# Altium project fitness_rubber_band_monitor_pcb.PrjPcb
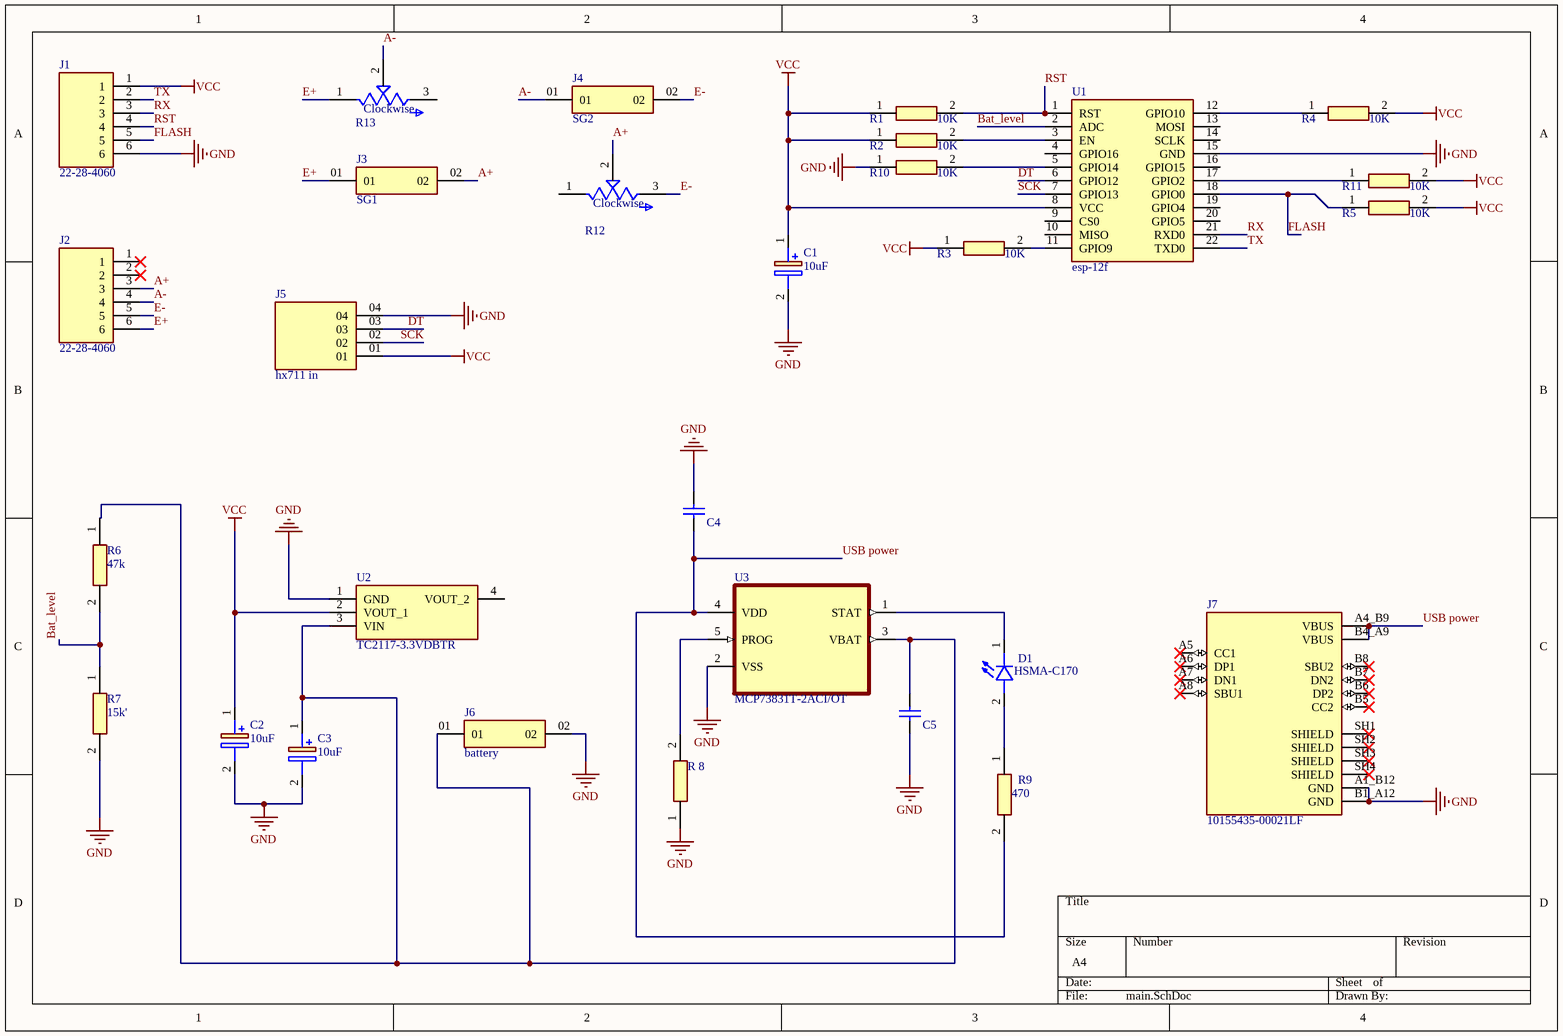
[diagram p0: main.SchDoc]
1 sheet, 29 parts. Net scope: global (net labels, ports and power ports of the same name join across sheets).
Board file: main.PcbDoc

## Sheet main.SchDoc
size A4; SheetNumber: 1; SheetTotal: 1

### Parts
C1  10uF  [EEE1AA220WR]
C2  10uF  [EEE1AA220WR]
C3  10uF  [EEE1AA220WR]
C4  4.7uF  [WCAP-CSGP_0805_L2W1.25H0.6_Reflow]  (value not drawn)
C5  4.7uF  [WCAP-CSGP_0805_L2W1.25H0.6_Reflow]  (value not drawn)
D1  HSMA-C170  [LED_HSMA-C170]
J1  22-28-4060  [HDRV6W66P0X254_1X6_1524X249X838P]
J2  22-28-4060  [HDRV6W66P0X254_1X6_1524X249X838P]
J3  SG1  [SAMTEC_MTSW-101-08-G-D-250]
J4  SG2  [SAMTEC_MTSW-101-08-G-D-250]
J5  hx711 in  [SAMTEC_TSW-104-16-G-S]
J6  battery  [SAMTEC_MTSW-101-08-G-D-250]
J7  10155435-00021LF  [AMPHENOL_10155435-00021LF]
R1  10K  [RESC2012X60N]
R2  10K  [RESC2012X60N]
R3  10K  [RESC2012X60N]
R4  10K  [RESC2012X60N]
R5  10K  [RESC2012X60N]
R6  47k  [RESC2012X60N]
R7  15k'  [RESC2012X60N]
R9  470  [RESC2012X60N]
R10  10K  [RESC2012X60N]
R11  10K  [RESC2012X60N]
R12  PV37W501C01B00  [TRIM_PV37W501C01B00]  (value not drawn)
R13  PV37W501C01B00  [TRIM_PV37W501C01B00]  (value not drawn)
R_8  CR0805-JW-202ELF  [RESC2012X60N]  (value not drawn)
U1  esp-12f  [esp12f]
U2  TC2117-3.3VDBTR  [SOT230P700X180-4N]
U3  MCP73831T-2ACI/OT  [SOT95P280X145-5N]

### Nets
GND: C1.2(-) C2.2(-) C3.2(-) C4.1 C5.1 J1.6 J5.04 J6.02 J7.A1_B12(GND) J7.B1_A12(GND) R7.2 R10.1 R_8.1 U1.15(GND) U2.1(GND) U3.2(VSS)
VCC: C1.1(+) C2.1(+) J1.1 J5.01 R1.1 R2.1 R3.1 R4.2 R5.2 R11.2 U1.8(VCC) U2.2(VOUT_1)
A+: J2.3 J3.02 R12.2
A-: J2.4 J4.01 R13.2
Bat_level: R6.2 R7.1 U1.2(ADC)
DT: J5.03 U1.6(GPIO12)
E+: J2.6 J3.01 R13.1
E-: J2.5 J4.02 R12.3
FLASH: J1.5 R5.1 U1.18(GPIO0)
RST: J1.4 R1.2 U1.1(RST)
RX: J1.3 U1.21(RXD0)
SCK: J5.02 U1.7(GPIO13)
TX: J1.2 U1.22(TXD0)
USB power: C4.2 J7.A4_B9(VBUS) J7.B4_A9(VBUS) R9.2 U3.4(VDD)
NetC3_1: C3.1(+) C5.2 J6.01 R6.1 U2.3(VIN) U3.3(VBAT)
NetD1_1: D1.1(C) U3.1(STAT)
NetD1_2: D1.2(A) R9.1
NetR2_2: R2.2 U1.3(EN)
NetR3_2: R3.2 U1.11(GPIO9)
NetR4_1: R4.1 U1.12(GPIO10)
NetR10_2: R10.2 U1.5(GPIO14)
NetR11_1: R11.1 U1.17(GPIO2)
NetR_8_2: R_8.2 U3.5(PROG)

Not connected (* = marked no-connect by the designer): J2 1* 2*; J7 A5(CC1)* A6(DP1)* A7(DN1)* A8(SBU1)* B5(CC2)* B6(DP2)* B7(DN2)* B8(SBU2)* SH1(SHIELD)* SH2(SHIELD)* SH3(SHIELD)* SH4(SHIELD)*; R12 1; R13 3; U1 4(GPIO16) 9(CS0) 10(MISO) 13(MOSI) 14(SCLK) 16(GPIO15) 19(GPIO4) 20(GPIO5); U2 4(VOUT_2)

### Notes on the sheet
- (in symbol PV37W501C01B00) Clockwise

### Library data of the parts
C1-C3 = EEE-FN1C100R: Capacitor Polarised; Manufacturer_Name: Panasonic; Datasheet Link: http://industrial.panasonic.com/cdbs/www-data/pdf/RDE0000/RDE0000C1259.pdf; Height: 5.5mm; Manufacturer_Part_Number: EEE-FN1C100R; Mouser Part Number: 667-EEE-FN1C100R; Mouser Price/Stock: https://www.mouser.co.uk/ProductDetail/Panasonic/EEE-FN1C100R?qs=OlC7AqGiEDkM1emDreS51w%3D%3D; Arrow Part Number: EEE-FN1C100R; Arrow Price/Stock: https://www.arrow.com/en/products/eee-fn1c100r/panasonic?region=nac
C4 C5 = 885012007049: WCAP-CSGP Multilayer Ceramic Chip Capacitor, General Purpose, size 0805, NP0, 4.7pF, 50VDC; Manufacturer: Wurth Elektronik; Case/Size Code: 0805; Capacitance Tolerance: +/-0.5pF; Insulation Resistance: 10GOhm; Q Factor: 494; Rated Voltage (DC): 50V; Technical Reference: NP008054R7D050DFCT10000; Manufacturer Part Number: 885012007049; Category: Multilayer Ceramic Chip Capacitors; Match Code: WCAP-CSGP; ComponentLink1Description: Website Link; ComponentLink1URL: https://www.we-online.com/redexpert/article/885012007049?ad; ComponentLink2Description: Datasheet Link; ComponentLink2URL: https://www.we-online.com/redexpert/spec/885012007049?ad; Mount: Surface Mount; Operating Temperature Max: 125°C; Operating Temperature Min: -55°C; Packaging: Tape and Reel; Length: 2mm; Width: 1.25mm; Height: 0.6mm; Capacitance: 4.7pF; Ceramic Type: NP0
J1 J2 = CMP-002-00071-1: Connector; Manufacturer_Name: Molex; Mouser Part Number: 538-22-28-4060; Source: SamacSys.SchLib; Manufacturer_Part_Number: 22-28-4060; Datasheet Link: https://www.molex.com/pdm_docs/sd/022284060_sd.pdf; Mouser Price/Stock: https://www.mouser.co.uk/ProductDetail/Molex/22-28-4060?qs=d9fIA1aNikSACgwI0d%252BTOw%3D%3D; Height: 8.38mm; Design Item ID: 22-28-4060
J3 J4 J6 = MTSW-101-08-G-D-250: Package: None; Price: None; Value: *; MP: MTSW-101-08-G-D-250; Availability: Unavailable
J5 = TSW-104-16-G-S: Package: None; Price: None; Value: *; MP: TSW-104-16-G-S; Availability: Unavailable
R1-R7 R9-R11 = CHP0805-FX-1002ELF: Resistor; Manufacturer_Name: Bourns; Datasheet Link: https://ms.componentsearchengine.com/Datasheets/1/CHP0805-FX-1002ELF.pdf; Height: 0.6mm; Manufacturer_Part_Number: CHP0805-FX-1002ELF; Mouser Part Number: 652-CHP0805FX1002ELF; Mouser Price/Stock: https://www.mouser.co.uk/ProductDetail/Bourns/CHP0805-FX-1002ELF?qs=lc2O%252BfHJPVaDI6gsPdDtfw%3D%3D
R12 R13 = PV37W501C01B00: 500 Ohms 0.25W, 1/4W PC Pins Through Hole Trimmer Potentiometer Cermet 12.0 Turn Top Adjustment; MF: Bourns; SnapEDA_Link: https://www.snapeda.com/parts/PV37W501C01B00/Bourns/view-part/?ref=snap; Package: PV37W Bourns; Price: None; MP: PV37W501C01B00; Availability: In Stock; Purchase-URL: https://pricing.snapeda.com/search/part/PV37W501C01B00/?ref=eda; Value: *; Check_prices: https://www.snapeda.com/parts/PV37W501C01B00/Bourns/view-part/?ref=eda
R_8 = CR0805-JW-202ELF: Resistor; Manufacturer_Name: Bourns; Datasheet Link: https://www.bourns.com/pdfs/chpreztr.pdf; Height: 0.6mm; Manufacturer_Part_Number: CR0805-JW-202ELF; Mouser Part Number: 652-CR0805JW-202ELF; Mouser Price/Stock: https://www.mouser.co.uk/ProductDetail/Bourns/CR0805-JW-202ELF?qs=wL7NMIHXUPnyGz%2Fa3t%2FGQg%3D%3D; Arrow Part Number: CR0805-JW-202ELF; Arrow Price/Stock: https://www.arrow.com/en/products/cr0805-jw-202elf/bourns
U1 = esp-12f: Integrated Circuit; Manufacturer_Name: Ai-Thinker; Datasheet Link: https://docs.ai-thinker.com/_media/esp8266/docs/esp-12f_product_specification_en.pdf; Height: 3.1mm; Manufacturer_Part_Number: esp-12f
U2 = TC2117-3.3VDBTR: Power Supply; Manufacturer_Name: Microchip; Datasheet Link: https://componentsearchengine.com/Datasheets/2/TC2117-3.3VDBTR.pdf; Height: 1.8mm; Manufacturer_Part_Number: TC2117-3.3VDBTR; Mouser Part Number: 579-TC2117-3.3VDBTR; Mouser Price/Stock: https://www.mouser.co.uk/ProductDetail/Microchip-Technology/TC2117-3.3VDBTR?qs=AF%252BffTaPb30YsLOBvxArLw%3D%3D; Arrow Part Number: TC2117-3.3VDBTR; Arrow Price/Stock: https://www.arrow.com/en/products/tc2117-3.3vdbtr/microchip-technology?utm_currency=USD&region=nac
U3 = MCP73831T-2ACI/OT: Charger IC Lithium Ion/Polymer SOT-23-5; MF: Microchip; Package: SOT-23 Microchip; Purchase-URL: https://pricing.snapeda.com/search/part/MCP73831T-2ACI/OT/?ref=eda; MP: MCP73831T-2ACI/OT; Value: *; Availability: In Stock; SnapEDA_Link: https://www.snapeda.com/parts/MCP73831T-2ACI/OT/Microchip/view-part/?ref=snap; Price: None; Check_prices: https://www.snapeda.com/parts/MCP73831T-2ACI/OT/Microchip/view-part/?ref=eda
D1 = HSMA-C170: Value: *; Price: None; Package: None; MP: HSMA-C170; Availability: Unavailable
J7 = 10155435-00021LF: Package: None; Price: None; Value: *; MP: 10155435-00021LF; Availability: Unavailable